# EAGLE design Vumetro-v2 (EAGLE 6.3)
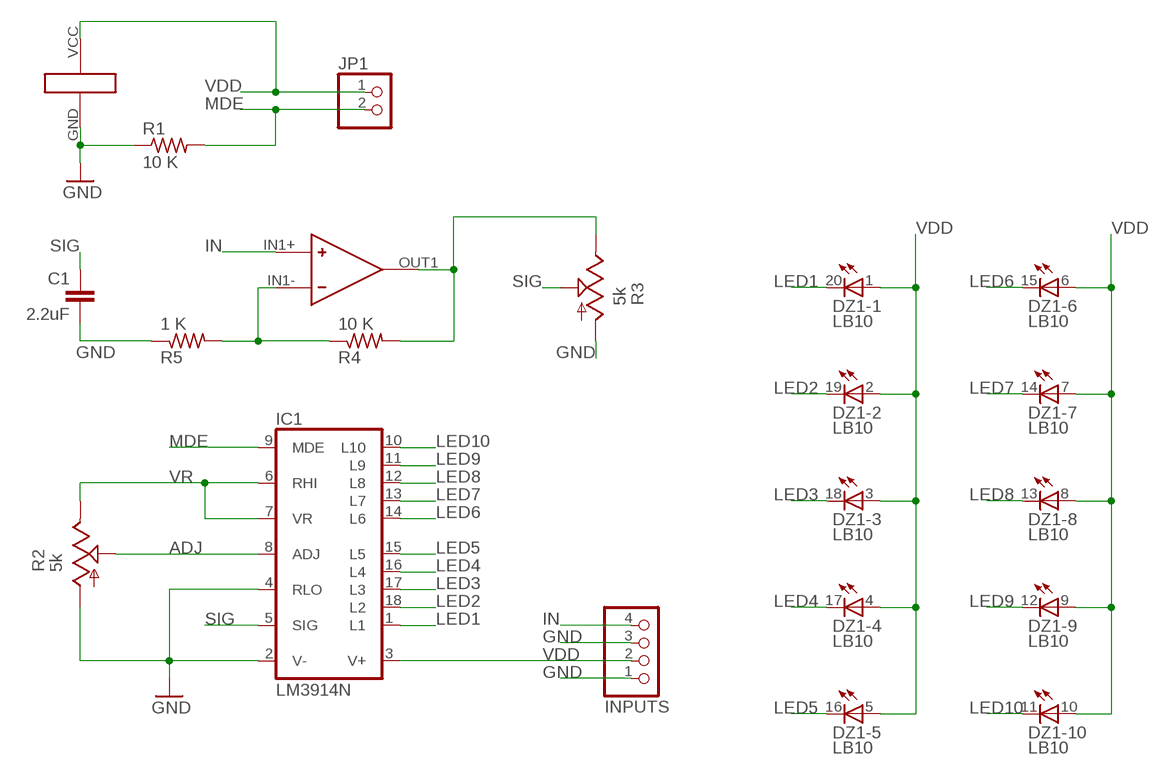
[diagram p0: schematic, sheet 1]

## Parts
C1  2.2uF  C2.5/6  [C2.5-6]
DZ1  LB10  [LB10]
IC1  LM3914N  [DIL18]
INPUTS  PINHD-1X4  [1X04]
JP1  PINHD-1X2  [1X02]
R1  10 K  R-US_0204/5  [0204/5]
R2  5k  TRIM_US-PT10  [PT-10]
R3  5k  TRIM_US-PT10  [PT-10]
R4  10 K  R-US_0204/5  [0204/5]
R5  1 K  R-US_0204/5  [0204/5]
U$1  LM358  [LM358]

## Nets
ADJ: IC1.8(ADJ) R2.S
GND: C1.2 IC1.2(V-) IC1.4(RLO) INPUTS.1 INPUTS.3 R1.1 R2.A R3.A R5.1 U$1.GND(POWER:GND)
IN: INPUTS.4 U$1.IN1+(OPAMP1:IN+)
LED1: DZ1.20(-1:C) IC1.1(L1)
LED2: DZ1.19(-2:C) IC1.18(L2)
LED3: DZ1.18(-3:C) IC1.17(L3)
LED4: DZ1.17(-4:C) IC1.16(L4)
LED5: DZ1.16(-5:C) IC1.15(L5)
LED6: DZ1.15(-6:C) IC1.14(L6)
LED7: DZ1.14(-7:C) IC1.13(L7)
LED8: DZ1.13(-8:C) IC1.12(L8)
LED9: DZ1.12(-9:C) IC1.11(L9)
LED10: DZ1.11(-10:C) IC1.10(L10)
MDE: IC1.9(MDE) JP1.2 R1.2
N$2: R4.1 R5.2 U$1.IN1-(OPAMP1:IN-)
N$3: R3.E R4.2 U$1.OUT1(OPAMP1:OUT)
SIG: C1.1 IC1.5(SIG) R3.S
VDD: DZ1.1(-1:A) DZ1.2(-2:A) DZ1.3(-3:A) DZ1.4(-4:A) DZ1.5(-5:A) DZ1.6(-6:A) DZ1.7(-7:A) DZ1.8(-8:A) DZ1.9(-9:A) DZ1.10(-10:A) IC1.3(V+) INPUTS.2 JP1.1 U$1.VCC(POWER:VCC)
VR: IC1.6(RHI) IC1.7(VR) R2.E
Unconnected: U$1.IN2+(OPAMP2:IN+) U$1.IN2-(OPAMP2:IN-) U$1.OUT2(OPAMP2:OUT)

## Library data of the parts
C1 = capacitor-wima:C: CAPACITOR naming: grid - package width
DZ1 = led:LB10: LED BLOCK 10-LED bar graph, DIL, Matos
IC1 = linear:LM3914N: LED DRIVER senses analog voltage levels and drives 10 LEDs
INPUTS = pinhead:PINHD-1X4: PIN HEADER
JP1 = pinhead:PINHD-1X2: PIN HEADER
R1 R4 R5 = resistor:R-US_: RESISTOR, American symbol
R2 R3 = pot:TRIM_US-: POTENTIOMETER
U$1 = CustumLib:LM358

## Board
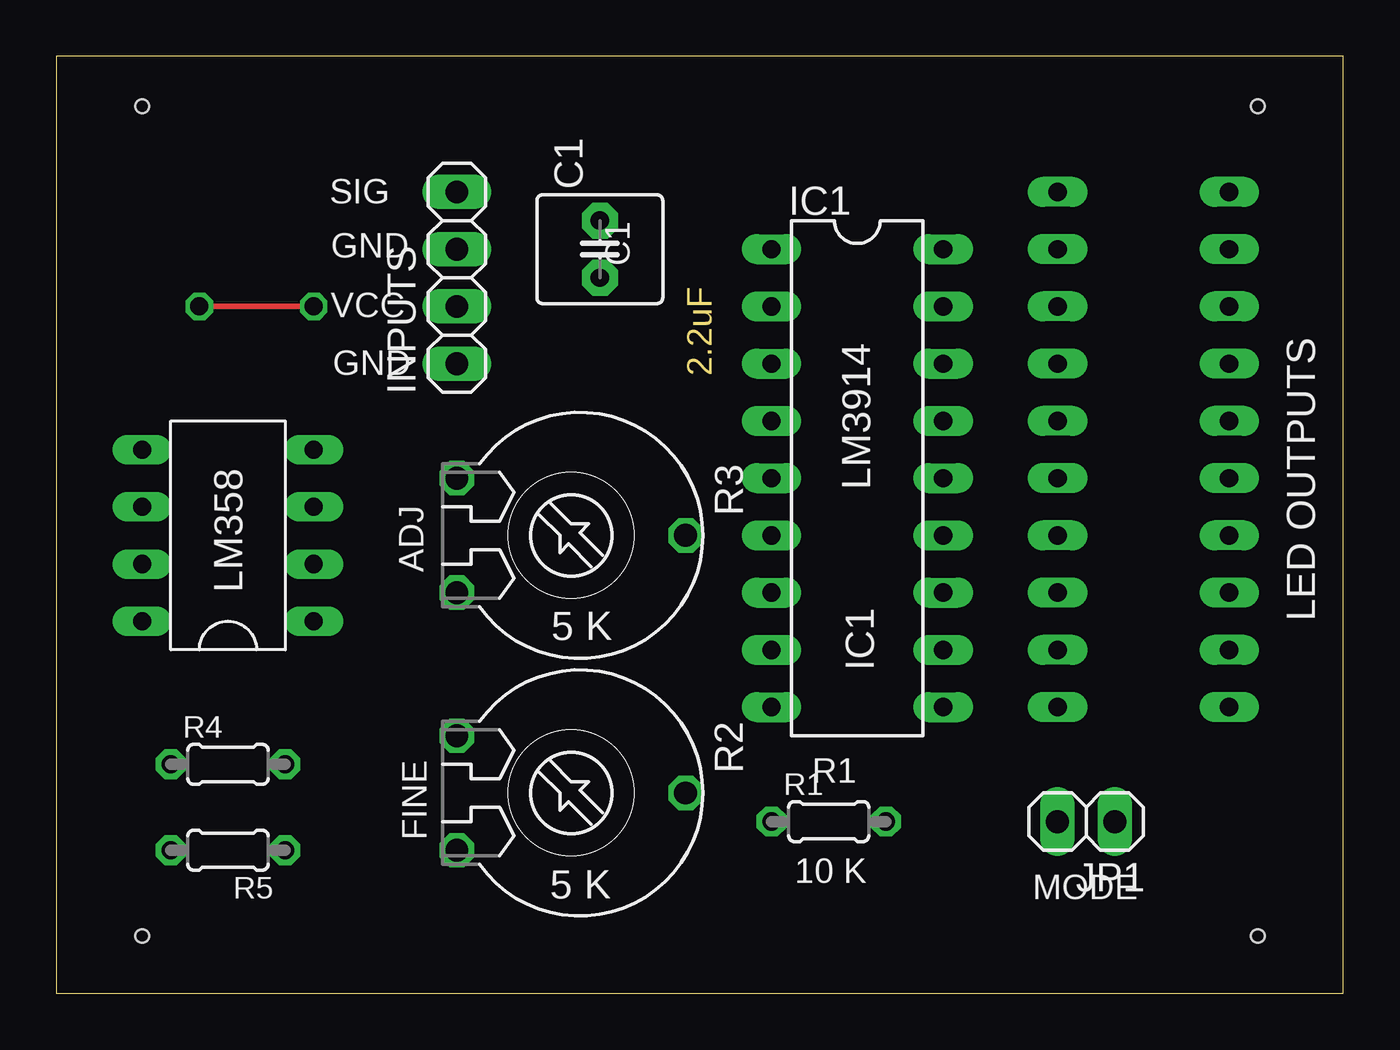
[diagram p1: board, top side]
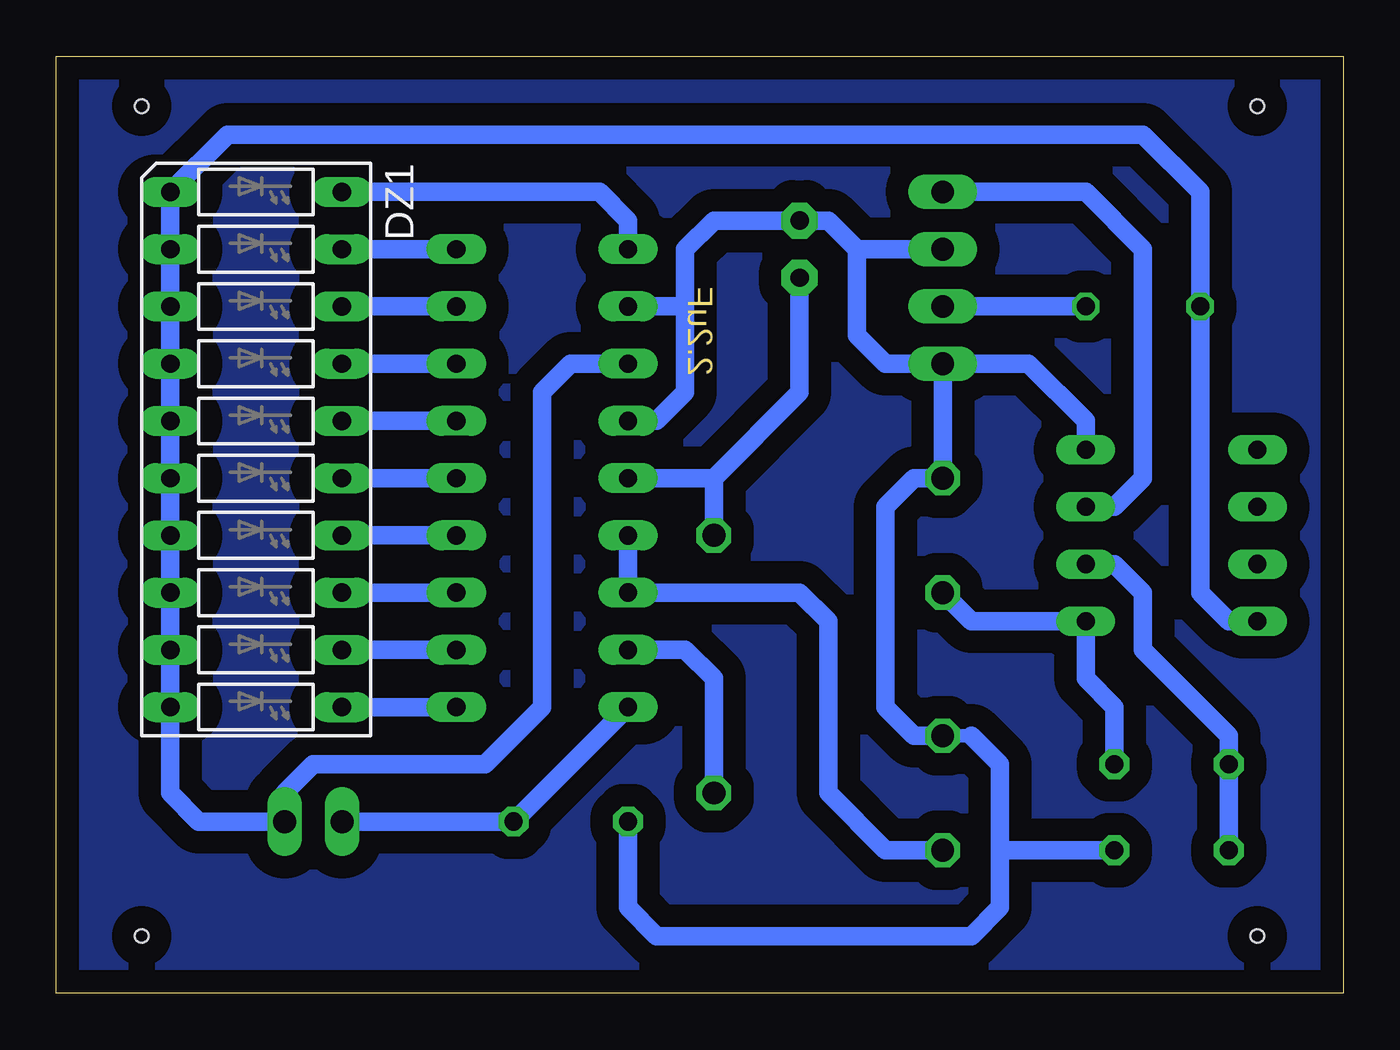
[diagram p2: board, bottom side, seen from below]

Size 57.13 x 41.58 mm. Coordinates in mm from the lower left corner, seen from the top.
Outline: 0,0 57.13,0 57.13,41.58 0,41.58 0,0
Copper layers (1*16): Top 0.035mm / dielectric 1.5mm / Bottom 0.035mm
Design rules "default": minimum track width 10mil, minimum drill 24mil, track to track 8mil, track to pad 8mil, pad to pad 8mil, via to via 8mil, smd to smd 8mil, copper to edge 40mil, drill to drill 8mil, minimum pad ring 10mil, minimum via ring 8mil, stop-mask expansion 4mil, vias tented up to drill 0mil, thermal gap 10mil
Holes 0.6 mm at 53.34,2.54 3.81,39.37 3.81,2.54 53.34,39.37

### Footprints (pad centres in the part's own frame; a part is rotated, then mirrored left to right if it is on the bottom)
C2.5-6 = drill 0.813 pad 1.6 octagon: 1 -1.27,0; 2 1.27,0
LB10 = drill 0.813 long: 1 -11.43,-3.81; 2 -8.89,-3.81; 3 -6.35,-3.81; 4 -3.81,-3.81; 5 -1.27,-3.81; 6 1.27,-3.81; 7 3.81,-3.81; 8 6.35,-3.81; 9 8.89,-3.81; 10 11.43,-3.81; 11 11.43,3.81; 12 8.89,3.81; 13 6.35,3.81; 14 3.81,3.81; 15 1.27,3.81; 16 -1.27,3.81; 17 -3.81,3.81; 18 -6.35,3.81; 19 -8.89,3.81; 20 -11.43,3.81
DIL18 = drill 0.813 long: 1 -10.16,-3.81; 2 -7.62,-3.81; 3 -5.08,-3.81; 4 -2.54,-3.81; 5 0,-3.81; 6 2.54,-3.81; 7 5.08,-3.81; 8 7.62,-3.81; 9 10.16,-3.81; 10 10.16,3.81; 11 7.62,3.81; 12 5.08,3.81; 13 2.54,3.81; 14 0,3.81; 15 -2.54,3.81; 16 -5.08,3.81; 17 -7.62,3.81; 18 -10.16,3.81
1X04 = drill 1.016 long: 1 -3.81,0; 2 -1.27,0; 3 1.27,0; 4 3.81,0
1X02 = drill 1.016 long: 1 -1.27,0; 2 1.27,0
0204/5 = drill 0.813 octagon: 1 -2.54,0; 2 2.54,0
PT-10 = drill 1.016 octagon: A -2.54,-5.08; E 2.54,-5.08; S 0,5.08
LM358 = drill 0.8 long: GND 3.81,-3.81; IN1+ 1.27,-3.81; IN1- -1.27,-3.81; IN2+ 3.81,3.81; IN2- 1.27,3.81; OUT1 -3.81,-3.81; OUT2 -1.27,3.81; VCC -3.81,3.81

### Placement (x,y rotation side)
C1  24.13,33.02 90 top
DZ1  48.26,24.13 270 bottom
IC1  35.56,22.86 270 top
INPUTS  17.78,31.75 90 top
JP1  45.72,7.62 180 top
R1  34.29,7.62 0 top
R2  22.86,8.89 270 top
R3  22.86,20.32 270 top
R4  7.62,10.16 0 top
R5  7.62,6.35 180 top
U$1  7.62,20.32 90 top

### Tracks (layer width: path | path; a pad name or v marks a point on that pad's centre or on a via)
ADJ
  Bottom 0.813: IC1.8 29.21,15.24 27.94,13.97 R2.S
GND
  Bottom 0.61: 16.51,11.43 R2.A
  Bottom 0.813: 29.21,30.48 IC1.2 | IC1.4 30.48,25.4 29.21,26.67 29.21,30.48 | 16.51,11.43 15.24,10.16 15.24,6.35 | 15.24,6.35 15.24,3.81 16.51,2.54 30.48,2.54 31.75,3.81 R1.1 | R5.1 15.24,6.35 | INPUTS.1 13.97,27.94 11.43,25.4 U$1.GND | R2.A 19.05,11.43 20.32,12.7 20.32,21.59 19.05,22.86 R3.A INPUTS.1 | INPUTS.3 21.59,33.02 | INPUTS.1 20.32,27.94 21.59,29.21 21.59,33.02 | 21.59,33.02 22.86,34.29 C1.2 27.94,34.29 29.21,33.02 29.21,30.48
IN
  Bottom 0.813: INPUTS.4 11.43,35.56 8.89,33.02 8.89,22.86 10.16,21.59 U$1.IN1+
LED1
  Bottom 0.813: IC1.1 31.75,34.29 33.02,35.56 DZ1.20
LED2
  Bottom 0.813: IC1.18 DZ1.19
LED3
  Bottom 0.813: IC1.17 DZ1.18
LED4
  Bottom 0.813: IC1.16 DZ1.17
LED5
  Bottom 0.813: IC1.15 DZ1.16
LED6
  Bottom 0.813: IC1.14 DZ1.15
LED7
  Bottom 0.813: IC1.13 DZ1.14
LED8
  Bottom 0.813: IC1.12 DZ1.13
LED9
  Bottom 0.813: IC1.11 DZ1.12
LED10
  Bottom 0.813: IC1.10 DZ1.11
MDE
  Bottom 0.813: JP1.2 R1.2 IC1.9
N$1
  pour Bottom (isolate 1): 0,41.91 57.15,41.91 57.15,0 0,0
N$2
  Bottom 0.813: R5.2 R4.1 5.08,11.43 8.89,15.24 8.89,17.78 10.16,19.05 U$1.IN1-
N$3
  Bottom 0.813: R4.2 10.16,12.7 11.43,13.97 U$1.OUT1 16.51,16.51 R3.E
SIG
  Bottom 0.813: 27.94,22.86 IC1.5 | R3.S 27.94,22.86 | C1.1 24.13,26.67 27.94,22.86
VDD  (via drill 0.8)
  Top 0.25: v11.43,30.48 v6.35,30.48
  Bottom 0.813: IC1.3 34.29,27.94 35.56,26.67 35.56,12.7 38.1,10.16 45.72,10.16 46.99,8.89 JP1.1 50.8,7.62 52.07,8.89 DZ1.10 DZ1.9 DZ1.8 DZ1.7 DZ1.6 DZ1.5 DZ1.4 DZ1.3 DZ1.2 DZ1.1 49.53,38.1 8.89,38.1 6.35,35.56 v6.35,30.48 6.35,17.78 5.08,16.51 U$1.VCC | INPUTS.2 v11.43,30.48
VR
  Bottom 0.813: IC1.6 IC1.7 24.13,17.78 22.86,16.51 22.86,8.89 20.32,6.35 R2.E

### Text on the board
Dimension: 2.2uF
tPlace: SIG | GND | C1 | VCC | GND | ADJ | LM3914 | 5 K | LED OUTPUTS | IC1 | FINE | R1 | 5 K | 10 K | MODE